# Altium schematic sheet pastilda.SchDoc: pastilda
size 420 x 297 mm; Author: Ларионов; CompanyName: Третий Пин; Revision: Rev.0.1; SheetTotal: 1; PageSetup: Record=PageOptions|CenterHorizontal=False|CenterVertical=False|PrintScale=0.67|XCorrection=0.00|YCorrection=0.00|PrintKind=2|BorderSize=5000000|LeftOffset=0|BottomOffset=0|Orientation=2|PaperLength=1000|PaperWidth=1000|Scale=100|PaperSource=15|PrintQuality=-3|MediaType=1|DitherType=10|PrintScaleMode=1|PaperKind=A4|PaperIndex=9; DocumentType1: Схема электрическая; DocumentType2: Принципиальная; SchTitle: {Наименование}; Rule: PcbType=ProtelPcb
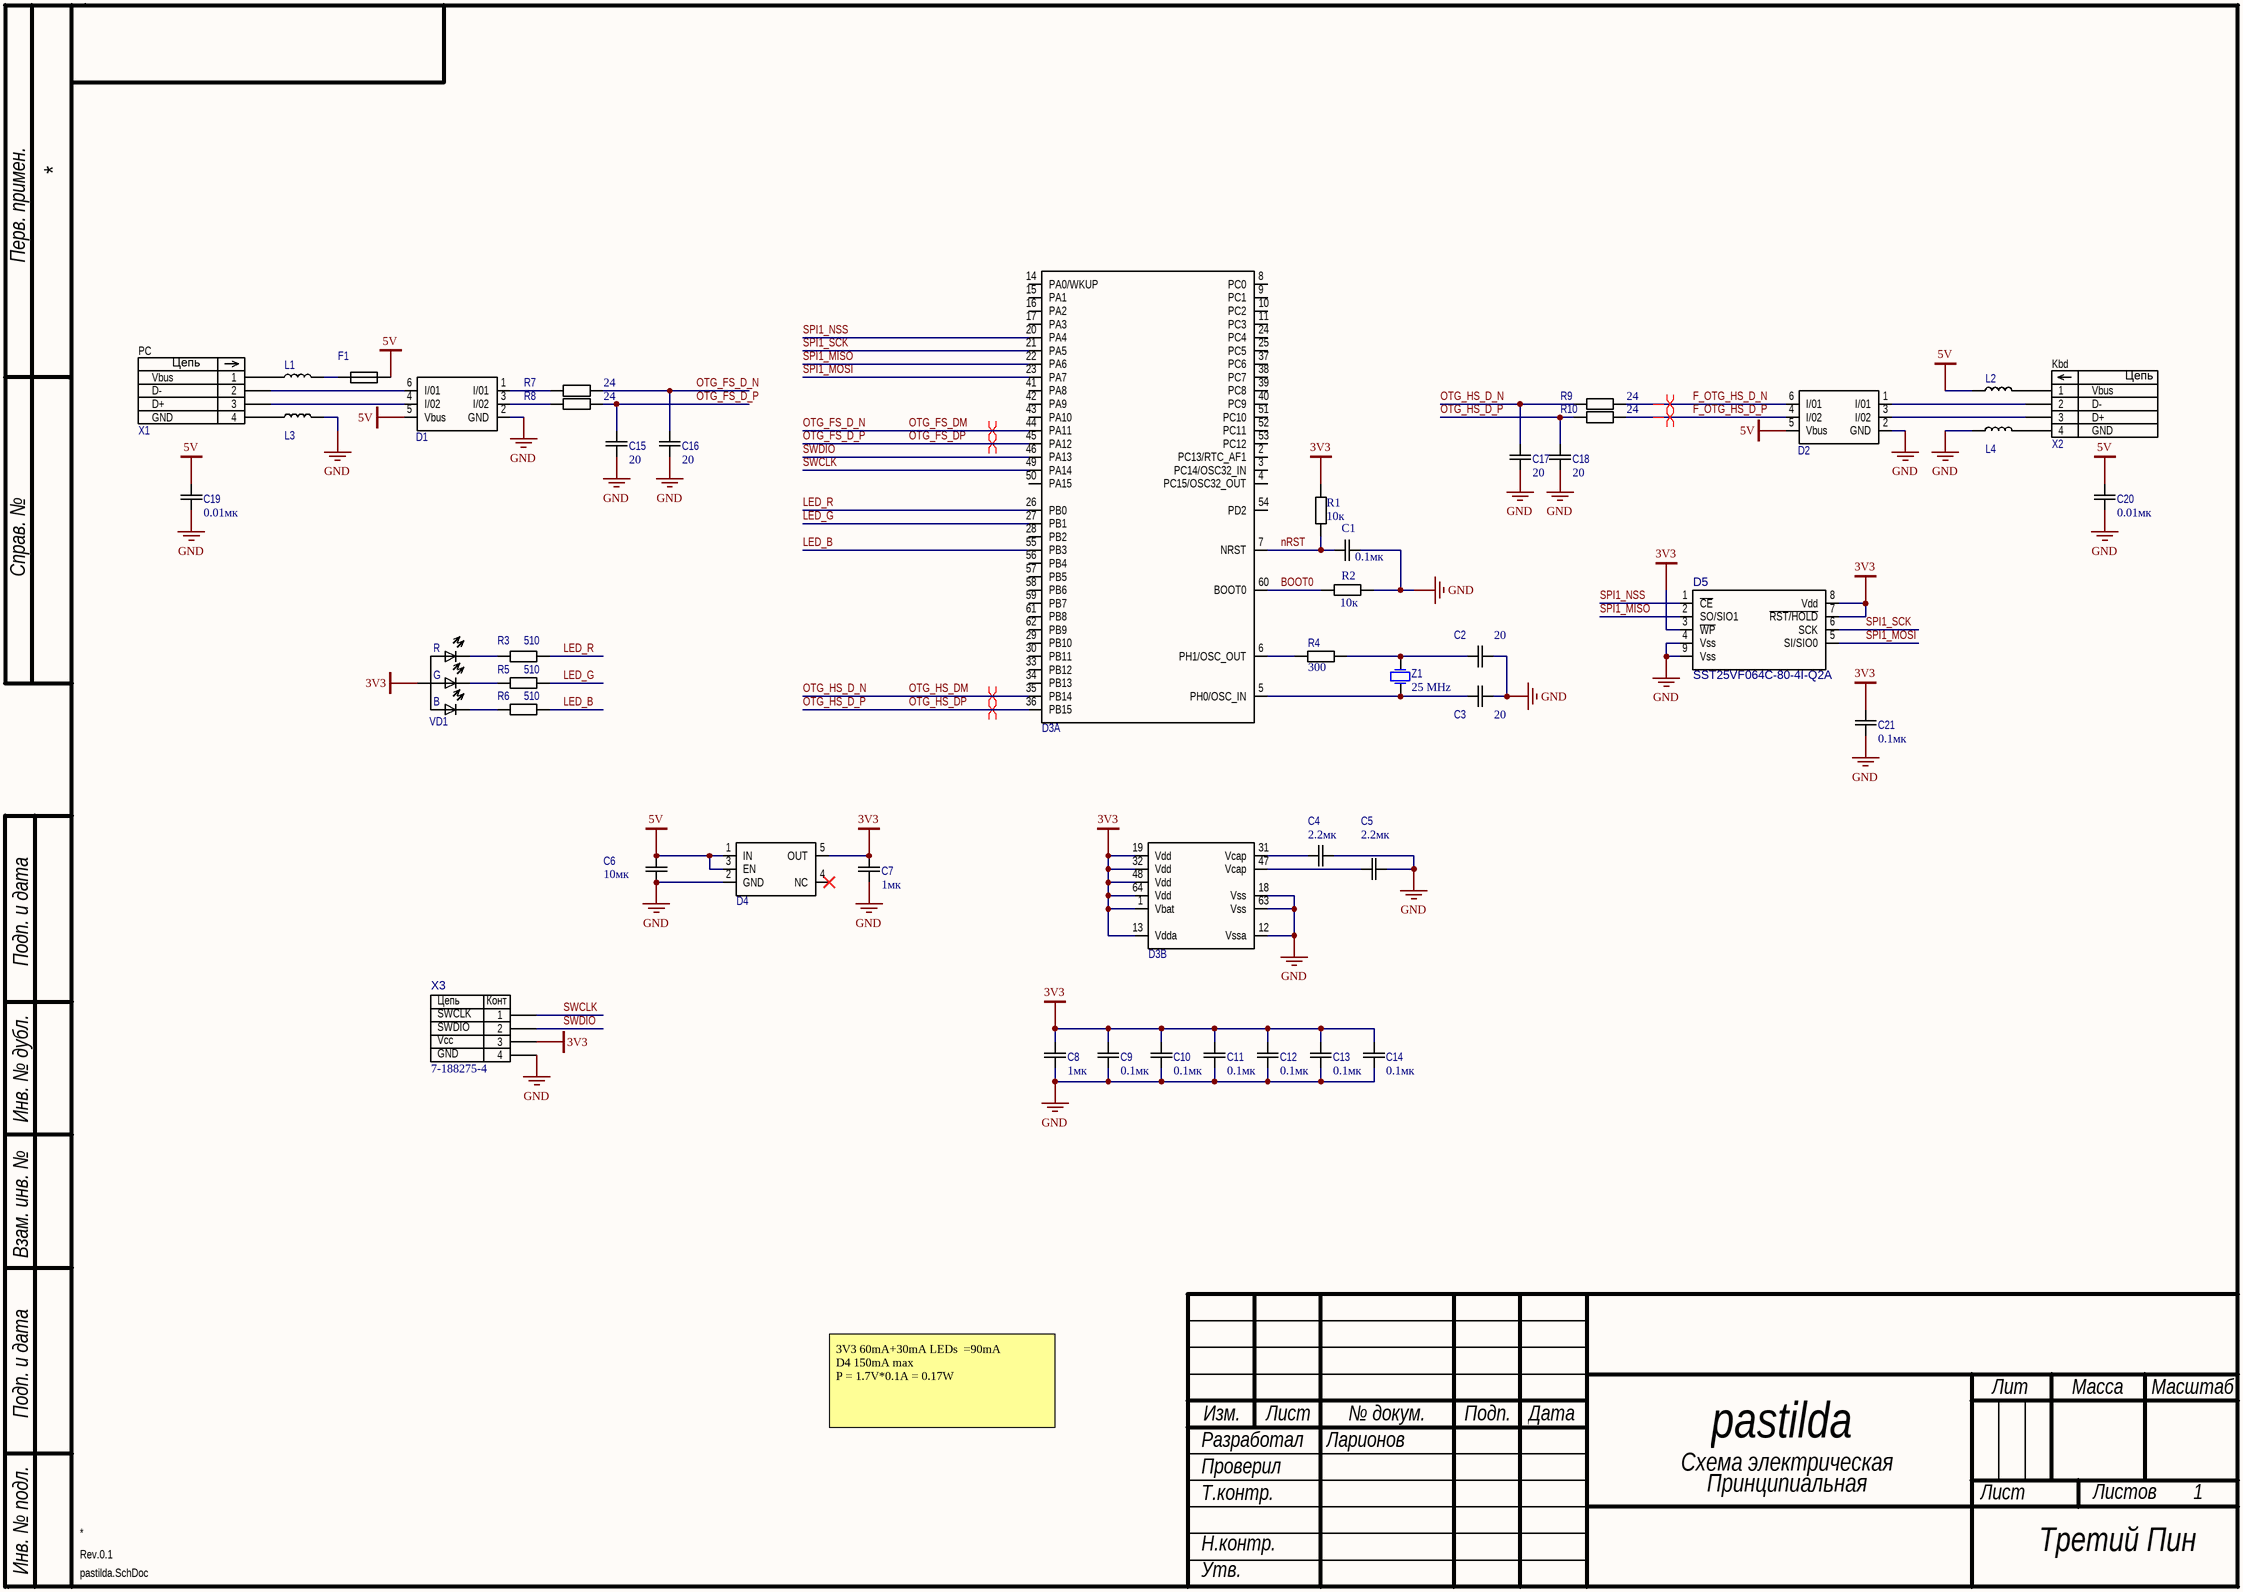
[diagram p0: pastilda.SchDoc]

## Parts
C1  value 0.1мк  [0603C]  (hidden comment: C)
C2  value 20  [0603C]  (hidden comment: C)
C3  value 20  [0603C]  (hidden comment: C)
C4  value 2.2мк  [0603C]  (hidden comment: C)
C5  value 2.2мк  [0603C]  (hidden comment: C)
C6  value 10мк  [0603C]  (hidden comment: C)
C7  value 1мк  [0603C]  (hidden comment: C)
C8  value 1мк  [0603C]  (hidden comment: C)
C9  value 0.1мк  [0603C]  (hidden comment: C)
C10  value 0.1мк  [0603C]  (hidden comment: C)
C11  value 0.1мк  [0603C]  (hidden comment: C)
C12  value 0.1мк  [0603C]  (hidden comment: C)
C13  value 0.1мк  [0603C]  (hidden comment: C)
C14  value 0.1мк  [0603C]  (hidden comment: C)
C15  value 20  [0603C]  (hidden comment: C)
C16  value 20  [0603C]  (hidden comment: C)
C17  value 20  [0603C]  (hidden comment: C)
C18  value 20  [0603C]  (hidden comment: C)
C19  value 0.01мк  [0603C]  (hidden comment: C)
C20  value 0.01мк  [0603C]  (hidden comment: C)
C21  value 0.1мк  [0603C]  (hidden comment: C)
D1  USBLC6-2  [SOT23-6]  (value not drawn)
D2  USBLC6-2  [SOT23-6]  (value not drawn)
D3  STM32F405RG  [LQFP64]  (value not drawn)  (parts A,B of 2)
D4  TPS76333DBV  [SOT23-5]  (value not drawn)
D5  SST25VF064C-80-4I-Q2A  [WSON8_6X8]
F1  MF-SMDF050-2  [F2018]  (value not drawn)
L1  BLM18AG  [0603C]  (value not drawn)
L2  BLM18AG  [0603C]  (value not drawn)
L3  BLM18AG  [0603C]  (value not drawn)
L4  BLM18AG  [0603C]  (value not drawn)
R1  value 10к  [0603R]  (hidden comment: R)
R2  value 10к  [0603R]  (hidden comment: R)
R3  value 510  [0603R]  (hidden comment: R)
R4  value 300  [0603R]  (hidden comment: R)
R5  value 510  [0603R]  (hidden comment: R)
R6  value 510  [0603R]  (hidden comment: R)
R7  value 24  [0603R]  (hidden comment: R)
R8  value 24  [0603R]  (hidden comment: R)
R9  value 24  [0603R]  (hidden comment: R)
R10  value 24  [0603R]  (hidden comment: R)
VD1  FYLS-3528RGBC  [FYLS-3528]  (value not drawn)
X1  1734028-1  [1734028-1]  (value not drawn)
X2  292303-1  [292303-1]  (value not drawn)
X3  7-188275-4  [7-188275-4]
Z1  value 25 MHz  [KX-7]  (hidden comment: KX-7)

## Nets
3V3: C7.2 C8.2 C9.2 C10.2 C11.2 C12.2 C13.2 C14.2 C21.2 D3.1(Vbat) D3.13(Vdda) D3.19(Vdd) D3.32(Vdd) D3.48(Vdd) D3.64(Vdd) D4.5(OUT) D5.3(~{WP}) D5.7(~{RST/HOLD}) D5.8(Vdd) R1.2 VD1.2(A) X3.3
5V: C6.2 C19.2 C20.2 D1.5(Vbus) D2.5(Vbus) D4.1(IN) D4.3(EN) F1.2 L2.1
GND: C1.1 C2.2 C3.2 C4.2 C5.2 C6.1 C7.1 C8.1 C9.1 C10.1 C11.1 C12.1 C13.1 C14.1 C15.1 C16.1 C17.1 C18.1 C19.1 C20.1 C21.1 D1.2(GND) D2.2(GND) D3.12(Vssa) D3.18(Vss) D3.63(Vss) D4.2(GND) D5.4(Vss) D5.9(Vss) L3.2 L4.1 R2.2 X1.0(GND) X2.0(GND) X3.4
BOOT0: D3.60(BOOT0) R2.1
F_OTG_HS_D_N: D2.6(I/01) R9.1
F_OTG_HS_D_P: D2.4(I/02) R10.1
LED_B: D3.55(PB3) R6.1
LED_G: D3.27(PB1) R5.1
LED_R: D3.26(PB0) R3.1
nRST: C1.2 D3.7(NRST) R1.1
OTG_FS_D_N: C16.2 D3.44(PA11) R7.2  [also labelled OTG_FS_DM]
OTG_FS_D_P: C15.2 D3.45(PA12) R8.2  [also labelled OTG_FS_DP]
OTG_HS_D_N: C17.2 D3.35(PB14) R9.2  [also labelled OTG_HS_DM]
OTG_HS_D_P: C18.2 D3.36(PB15) R10.2  [also labelled OTG_HS_DP]
SPI1_MISO: D3.22(PA6) D5.2(SO/SIO1)
SPI1_MOSI: D3.23(PA7) D5.5(SI/SIO0)
SPI1_NSS: D3.20(PA4) D5.1(~{CE})
SPI1_SCK: D3.21(PA5) D5.6(SCK)
SWCLK: D3.49(PA14) X3.1
SWDIO: D3.46(PA13) X3.2
NetC2_1: C2.1 R4.2 Z1.1(OSC1)
NetC3_1: C3.1 D3.5(PH0/OSC_IN) Z1.2(OSC2)
NetC4_1: C4.1 D3.31(Vcap)
NetC5_1: C5.1 D3.47(Vcap)
NetD1_1: D1.1(I/01) R7.1
NetD1_3: D1.3(I/02) R8.1
NetD1_4: D1.4(I/02) X1.3
NetD1_6: D1.6(I/01) X1.2
NetD2_1: D2.1(I/01) X2.2
NetD2_3: D2.3(I/02) X2.3
NetD3_6: D3.6(PH1/OSC_OUT) R4.1
NetF1_1: F1.1 L1.2
NetL1_1: L1.1 X1.1
NetL2_2: L2.2 X2.1
NetL3_1: L3.1 X1.4
NetL4_2: L4.2 X2.4
NetR3_2: R3.2 VD1.1(R)
NetR5_2: R5.2 VD1.4(G)
NetR6_2: R6.2 VD1.3(B)

Not connected (* = marked no-connect by the designer): D3 2(PC13/RTC_AF1) 3(PC14/OSC32_IN) 4(PC15/OSC32_OUT) 8(PC0) 9(PC1) 10(PC2) 11(PC3) 14(PA0/WKUP) 15(PA1) 16(PA2) 17(PA3) 24(PC4) 25(PC5) 28(PB2) 29(PB10) 30(PB11) 33(PB12) 34(PB13) 37(PC6) 38(PC7) 39(PC8) 40(PC9) 41(PA8) 42(PA9) 43(PA10) 50(PA15) 51(PC10) 52(PC11) 53(PC12) 54(PD2) 56(PB4) 57(PB5) 58(PB6) 59(PB7) 61(PB8) 62(PB9); D4 4(NC)*

## Layout directives
differential pair: F_OTG_HS_D_N, F_OTG_HS_D_P, OTG_FS_D_N, OTG_FS_D_P, OTG_HS_D_N, OTG_HS_D_P

## Notes on the sheet
- PC
- Vbus
- D-
- D+
- (near X2) Kbd
- (near X2) Vbus
- (near X2) D-
- GND
- (near X2) D+
- 3V3 60mA+30mA LEDs  =90mA
  D4 150mA max
  P = 1.7V*0.1A = 0.17W
- Перв. примен.
- Справ. №
- Подп. и дата
- Инв. № дубл.
- Взам. инв. №
- Лит
- Масса
- Масштаб
- Разработал
- Проверил
- Изм.
- Лист
- № докум.
- Подп.
- Дата
- Инв. № подл.
- Т.контр.
- Листов
- Утв.
- Н.контр.
- (in symbol 7-188275-4) Цепь; Конт
- (in symbol 292303-1) Цепь
- (in symbol 1734028-1) Цепь

## Library data of the parts
C1 = C cer 0603 X7R 0.1мк 50В 10% -55…125: Керамический ЧИП конденсатор; GPartNumber: К10-79-10; Footprit Path: RLC.pcblib; Voltage/Power: 50В; Tolerance: 10%; TU: АЖЯР.673511.004; Part Number: C cer 0603 X7R 0.1мк 50В 10% -55…125; Package: 0603
C2 C3 C15-C18 = C cer 0603 NPO 20 50В 5% -55…125: Керамический ЧИП конденсатор; GPartNumber: К10-79-10; TU: АЖЯР.673511.004; Footprit Path: RLC.pcblib; Voltage/Power: 50В; Tolerance: 5%; Part Number: C cer 0603 NPO 20 50В 5% -55…125; Package: 0603
C4 C5 = C cer 0603 X7R 2.2мк 10В 10% -55…125: Керамический ЧИП конденсатор; GPartNumber: К10-79-10; TU: АЖЯР.673511.004; Footprit Path: RLC.pcblib; Voltage/Power: 10В; Tolerance: 10%; Part Number: C cer 0603 X7R 2.2мк 10В 10% -55…125; ComponentLink1Description: Manufacturer Link; ComponentLink2Description: Datasheet; Package: 0603
C6 = C cer 0603 X5R 10мк 6.3В 20% -55…85: Керамический ЧИП конденсатор; GPartNumber: К10-79-10; TU: АЖЯР.673511.004; Footprit Path 2: RLC.pcblib; Voltage/Power: 6.3В; Tolerance: 10%; Part Number: C cer 0603 X5R 10мк 6.3В 20% -55…85; ComponentLink1Description: Manufacturer Link; ComponentLink2Description: Datasheet; Footprit Path: RLC.pcblib; Package: 0603
C7 C8 = C cer 0603 X5R 1мк 25В 10% -55…85: Керамический ЧИП конденсатор; GPartNumber: К10-79-10; TU: АЖЯР.673511.004; Footprit Path: RLC.pcblib; Voltage/Power: 25В; Tolerance: 10%; Part Number: C cer 0603 X5R 1мк 25В 10% -55…85; Package: 0603
C9-C14 C21 = C cer 0603 X7R 0.1мк 50В 10% -55…125: Керамический ЧИП конденсатор; GPartNumber: К10-79-10; TU: АЖЯР.673511.004; Footprit Path: RLC.pcblib; Voltage/Power: 50В; Tolerance: 10%; Part Number: C cer 0603 X7R 0.1мк 50В 10% -55…125; Package: 0603
C19 C20 = C cer 0603 X7R 0.01мк 50В 10% -55…125: Керамический ЧИП конденсатор; GPartNumber: К10-79-10; TU: АЖЯР.673511.004; Footprit Path: RLC.pcblib; Voltage/Power: 50В; Tolerance: 10%; Part Number: C cer 0603 X7R 0.01мк 50В 10% -55…125; ComponentLink1Description: Manufacturer Link; ComponentLink2Description: Datasheet; Package: 0603
D1 D2 = USBLC6-2SC6: Very low capacitance ESD protection; Footprit Path: IC.pcblib; Part Number: USBLC6-2SC6; ComponentLink1Description: Manufacturer Link; ComponentLink2Description: Datasheet; ComponentLink2URL: http://www.st.com/st-web-ui/static/active/en/resource/technical/document/datasheet/CD00050750.pdf; Package: SOT23-6
D3 = STM32F405RG: Микроконтроллер Cortex-M4 1Mb; GPartNumber: 1986ВЕ94Т; Footprit Path: IC.pcblib; TU: АЕЯР.431290.711; Part Number: STM32F405RG; ComponentLink1Description: Manufacturer Link; ComponentLink1URL: http://www.st.com/; ComponentLink2Description: Datasheet; ComponentLink2URL: http://www.st.com/content/ccc/resource/technical/document/datasheet/ef/92/76/6d/bb/c2/4f/f7/DM00037051.pdf/files/DM00037051.pdf/jcr:content/translations/en.DM00037051.pdf; Package: LQFP64
D4 = TPS76333DBV: LDO 150mA 3.3-10V to 3.3V; Footprit Path: IC.pcblib; Part Number: TPS76333DBV; ComponentLink1Description: Manufacturer Link; ComponentLink1URL: http://www.ti.com/; ComponentLink2Description: Datasheet; ComponentLink2URL: http://www.ti.com/lit/gpn/tps76333; Package: SOT23-5
D5 = SST25VF064C-80-4I-Q2A: 64 Mbit SPI Serial Dual I/O Flash; GPartNumber: 1636РР1У; Footprit Path: IC.pcblib; TU: АЕЯР.431210.647; Part Number: SST25VF064C-80-4I-Q2A; ComponentLink1Description: Manufacturer Link; ComponentLink1URL: http://www.microchip.com/; ComponentLink2Description: Datasheet; ComponentLink2URL: http://ww1.microchip.com/downloads/en/DeviceDoc/25036B.pdf; Package: WSON8
F1 = MF-SMDF050-2: Предохранитель; GPartNumber: ПК-30; Value: 0.55A; Footprit Path: Other.pcblib; Voltage/Power: 60V; TU: АГО.481.501 ТУ; Part Number: MF-SMDF050-2; ComponentLink1Description: Manufacturer Link; ComponentLink2Description: Datasheet; Package: SMD 2018
L1-L4 = BLM18AG601SN1: Фильтр; GPartNumber: ДПМ-0,1; Value: 600Ом; TU: УВО.558.000; Footprit Path: RLC.pcblib; Voltage/Power: 500мА; Part Number: BLM18AG601SN1; ComponentLink1Description: Manufacturer Link; ComponentLink2Description: Datasheet; Package: 0603
R1 R2 = R 0603 10к 5%: ЧИП резистор; GPartNumber: Р1-12 - 0,1; Footprit Path: RLC.pcblib; Voltage/Power: 0.063Вт; Tolerance: 5%; TU: АЛЯР.434110.005; Part Number: R 0603 10к 5%; Package: 0603
R3 R5 R6 = R 0603 510 5%: ЧИП резистор; Footprit Path: RLC.pcblib; Voltage/Power: 0.063Вт; Tolerance: 5%; Part Number: R 0603 510 5%; Package: 0603
R4 = R 0603 300 5%: ЧИП резистор; GPartNumber: Р1-12 - 0,1; TU: АЛЯР.434110.005; Footprit Path: RLC.pcblib; Voltage/Power: 0.1Вт; Tolerance: 5%; Part Number: R 0603 300 5%; ComponentLink1Description: Manufacturer Link; ComponentLink2Description: Datasheet; Package: 0603
R7-R10 = R 0603 24 1%: ЧИП резистор; GPartNumber: Р1-12 - 0,1; TU: АЛЯР.434110.005; Footprit Path: RLC.pcblib; Voltage/Power: 0.1Вт; Tolerance: 10%; Part Number: R 0603 24 1%; Package: 0603
VD1 = FYLS-3528RGBC: RGB Светодиод; Footprit Path: DiodeTransistTirist.PcbLib; Part Number: FYLS-3528RGBC; ComponentLink1Description: Manufacturer Link; ComponentLink1URL: http://www.foryard-led.ru/led-fyls-3528rgbc.html; ComponentLink2Description: Datasheet; ComponentLink2URL: http://www.compel.ru/datapdf/foryard/pn/fyls-3528rgbc/f5cdcf09a85fe9baeb04894ac8c5aaf8.pdf; Package: FYLS-3528; Footprit Path 2: DiodeTransistTirist.PcbLib
X1 = 1734028-1: USB A вилка на плату SMD; Part Number: 1734028-1; ComponentLink1Description: Manufacturer Link; ComponentLink2Description: Datasheet; ComponentLink2URL: http://www.te.com/commerce/DocumentDelivery/DDEController?Action=showdoc&DocId=Customer+Drawing%7F1734028%7FC%7Fpdf%7FEnglish%7FENG_CD_1734028_C.pdf%7F1734028-1; Package: 1734028-1
X2 = 292303-1: USB A розетка на плату; Part Number: 292303-1; ComponentLink1Description: Manufacturer Link; ComponentLink2Description: Datasheet; ComponentLink2URL: http://www.te.com/commerce/DocumentDelivery/DDEController?Action=showdoc&DocId=Customer+Drawing%7F292303%7FE10%7Fpdf%7FEnglish%7FENG_CD_292303_E10.pdf%7F292303-1; Package: 292303-1
X3 = 7-188275-4: Розетка на плату; Net1: SWCLK; Net2: SWDIO; Net3: Vcc; Net4: GND; Footprit Path: Connector.PcbLib; Part Number: 7-188275-4; ComponentLink1Description: Manufacturer Link; ComponentLink2Description: Datasheet; Package: 7-188275-4
Z1 = KX – 7_25M: Кварцевый резонатор; GPartNumber: РК513; Footprit Path: Other.pcblib; TU: КЖДГ.433513.012; Part Number: KX – 7_25M; ComponentLink1Description: Manufacturer Link; ComponentLink2Description: Datasheet; ComponentLink2URL: http://geyer-electronic.de/uploads/tx_userartikelfrequenz/GEYER-KX-7_01.pdf; Package: KX-7